# EAGLE schematic Hephaestus v1_5 (EAGLE 6.5.0)
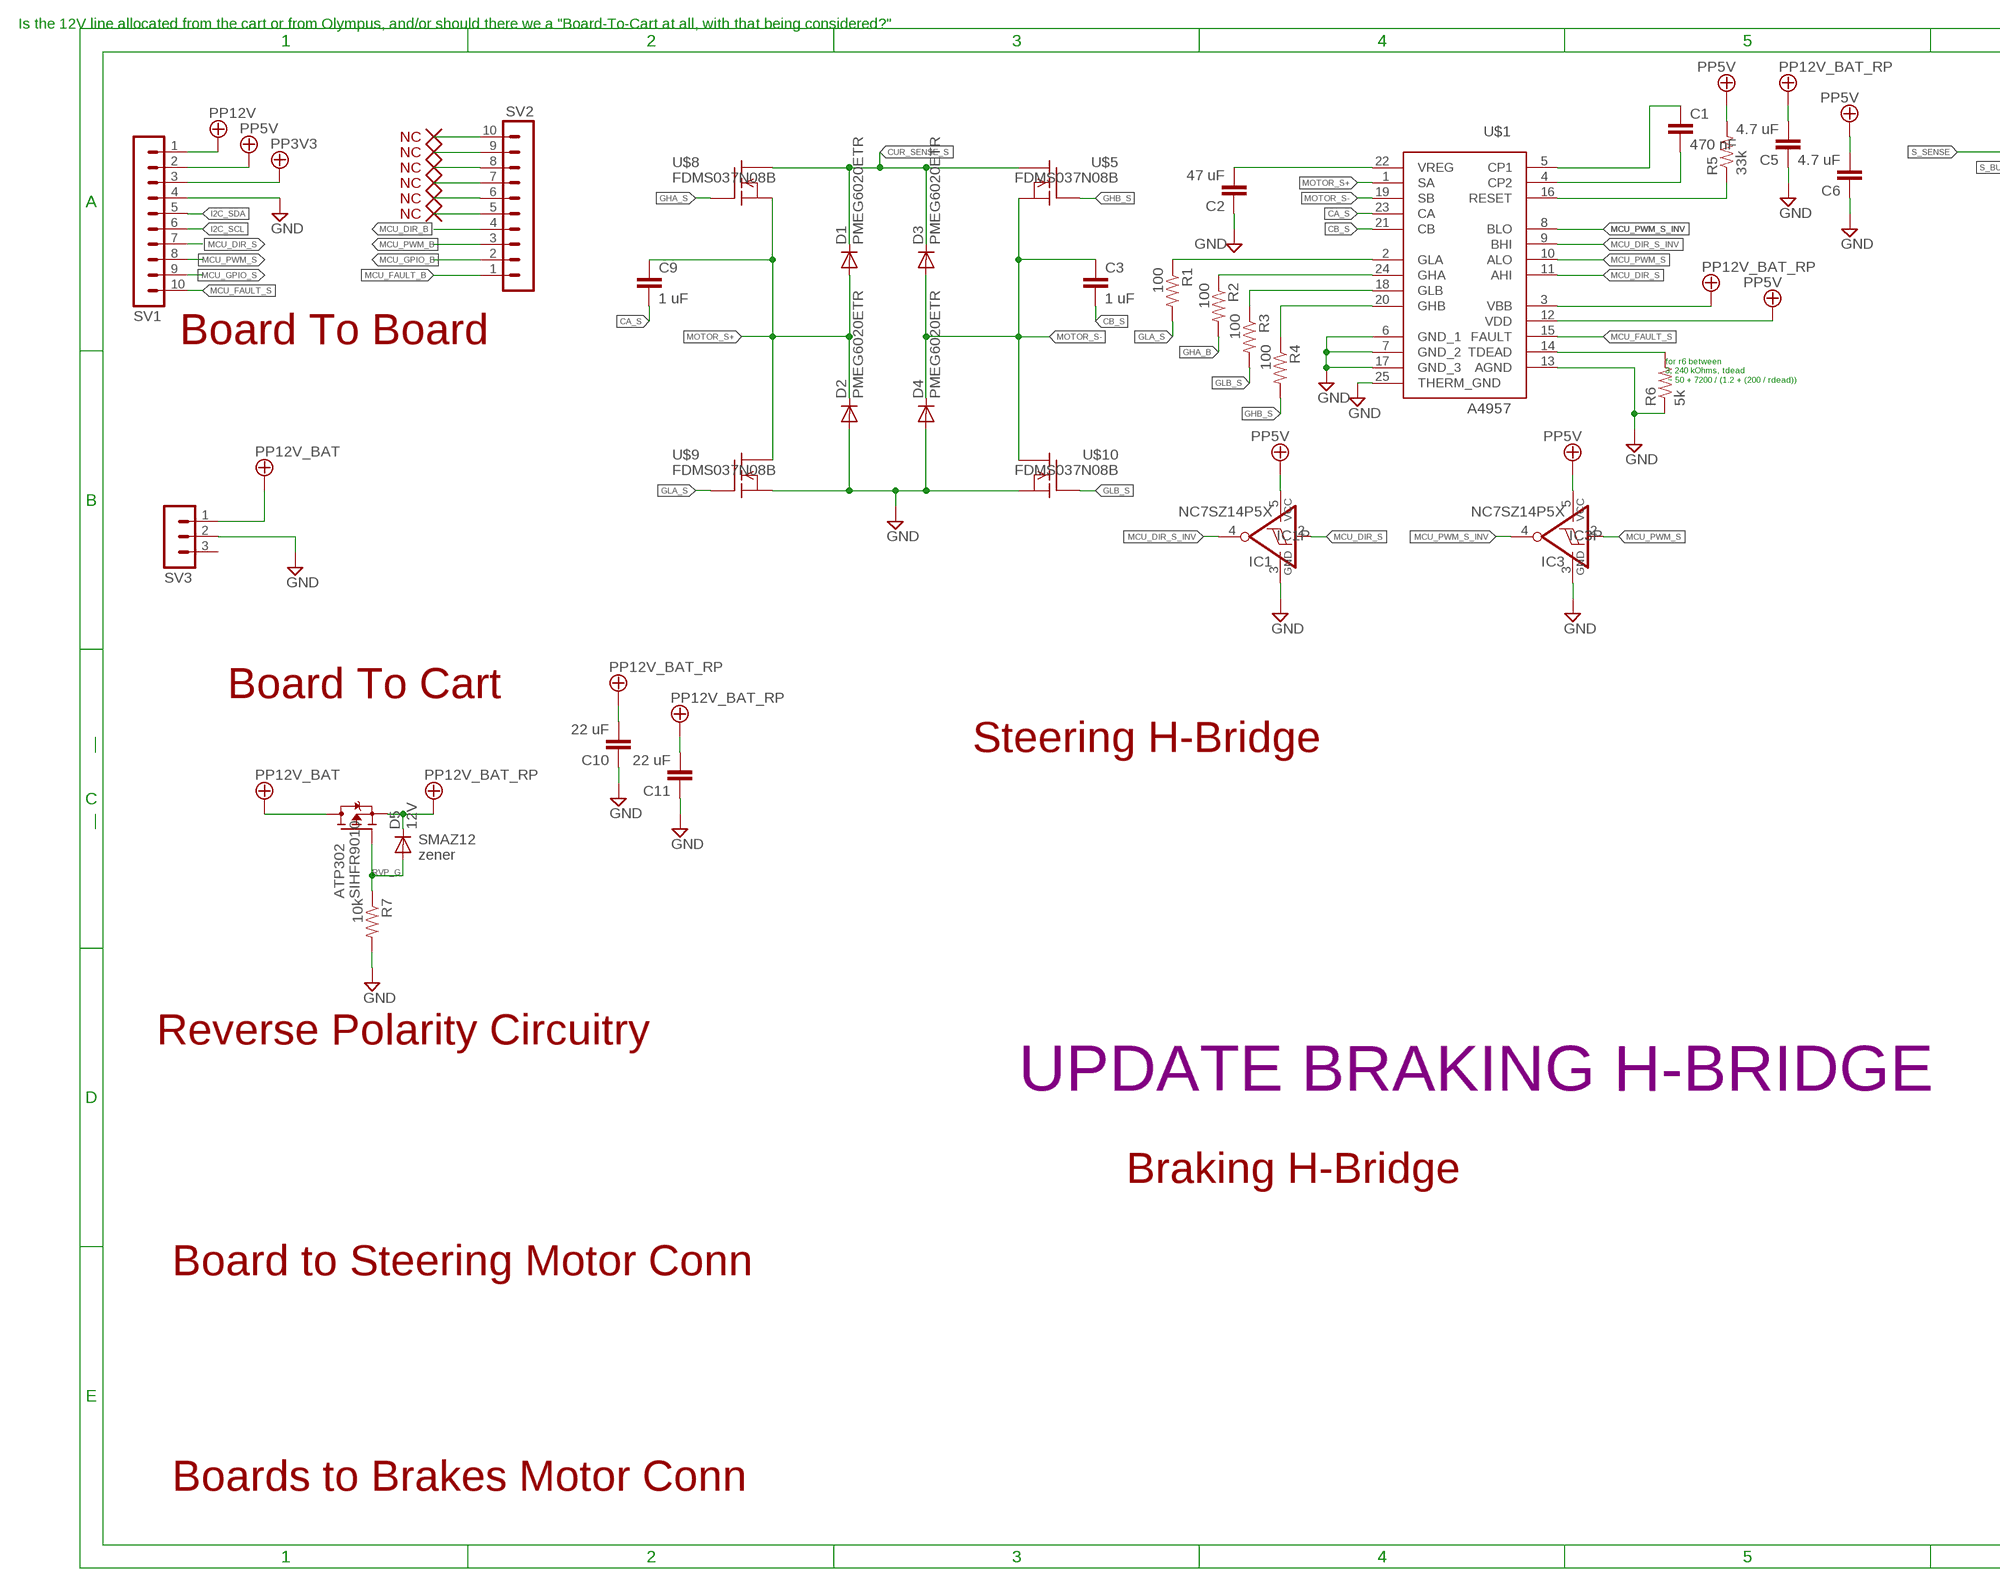
[diagram p0: schematic, sheet 1, part 1 of 2]
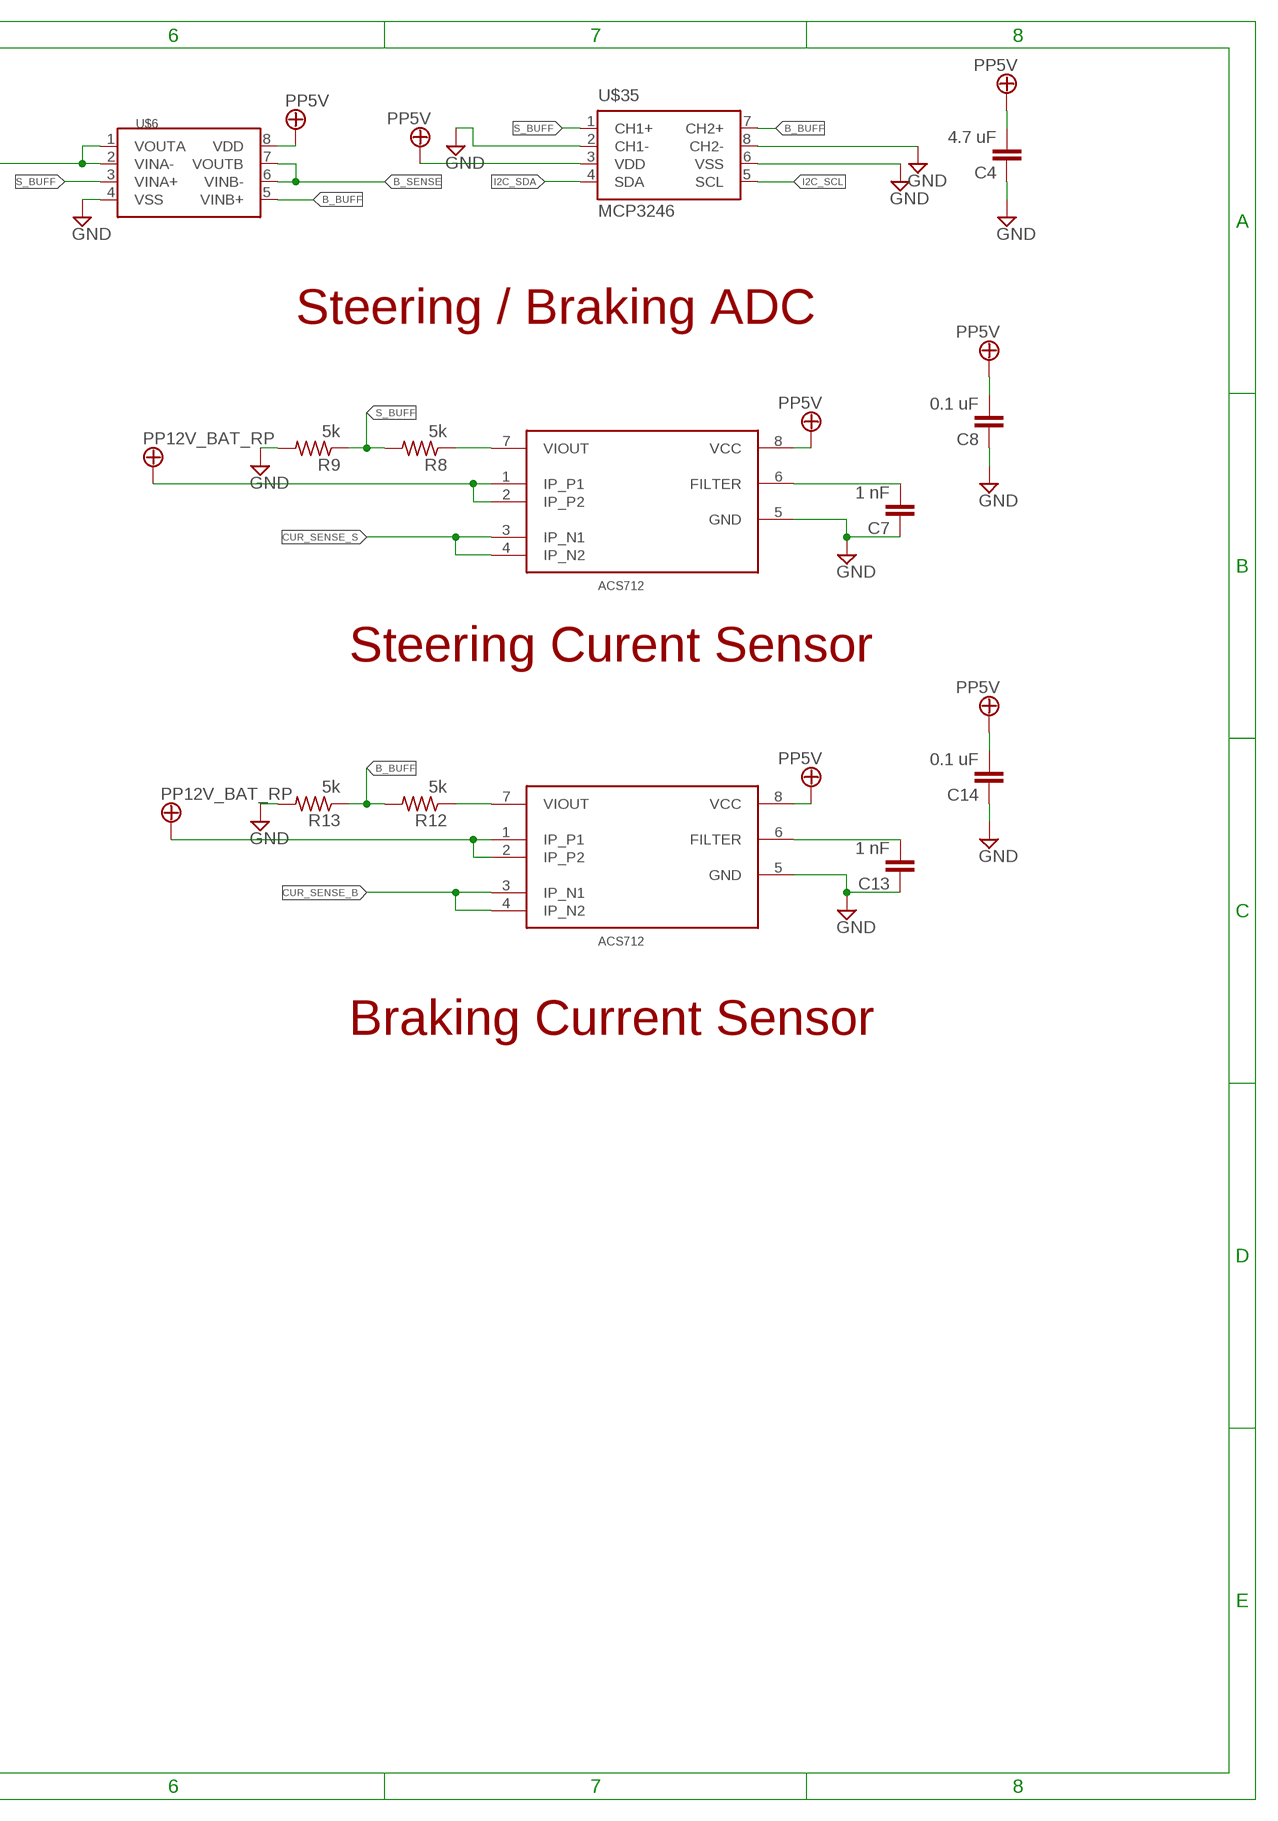
[diagram p1: schematic, sheet 1, part 2 of 2]

## Parts
ACS1  ACS712  [SOIC-08]
ACS712  ACS712  [SOIC-08]
C1  470 nF  CC0603  [C0603]
C2  47 uF  CC0603  [C0603]
C3  1 uF  CC0603  [C0603]
C4  4.7 uF  CC0603  [C0603]
C5  4.7 uF  CC0603  [C0603]
C6  4.7 uF  CC0603  [C0603]
C7  1 nF  CC0603  [C0603]
C8  0.1 uF  CC0603  [C0603]
C9  1 uF  CC0603  [C0603]
C10  22 uF  CC0603  [C0603]
C11  22 uF  CC0603  [C0603]
C13  1 nF  CC0603  [C0603]
C14  0.1 uF  CC0603  [C0603]
D1  PMEG6020ETR  [SOD123FL]
D2  PMEG6020ETR  [SOD123FL]
D3  PMEG6020ETR  [SOD123FL]
D4  PMEG6020ETR  [SOD123FL]
D5  12V  DIODE-DO214AC  [DO214AC]
IC1  NC7SZ14P5X  [SC70-5]
IC3  NC7SZ14P5X  [SC70-5]
R1  100  R-US_R0603  [R0603]
R2  100  R-US_R0603  [R0603]
R3  100  R-US_R0603  [R0603]
R4  100  R-US_R0603  [R0603]
R5  33k  R-US_R0603  [R0603]
R6  5k  R-US_R0603  [R0603]
R7  10k  R-US_R0603  [R0603]
R8  5k  R-US_R0603  [R0603]
R9  5k  R-US_R0603  [R0603]
R12  5k  R-US_R0603  [R0603]
R13  5k  R-US_R0603  [R0603]
SIHFR9010  ATP302  [TO252]
SV1  MA10-1  [MA10-1]
SV2  MA10-1  [MA10-1]
SV3  MA03-1  [MA03-1]
U$1  A4957  [24-WFQFN]
U$5  FDMS037N08B  [TO252]
U$6  MCP6L02  [SOIC-08]
U$8  FDMS037N08B  [TO252]
U$9  FDMS037N08B  [TO252]
U$10  FDMS037N08B  [TO252]
U$35  MCP3246  [MSOP8]

## Nets
B_BUFF: R12.2 R13.1 U$6.5(VINB+) U$35.7(CH2+)
B_SENSE: U$6.6(VINB-) U$6.7(VOUTB)
CA_S: C9.2 U$1.23(CA)
CB_S: C3.2 U$1.21(CB)
CS_1: ACS712.7(VIOUT) R8.1
CS_2: ACS1.7(VIOUT) R12.1
CUR_SENSE_B: ACS1.3(IP_N1) ACS1.4(IP_N2)
CUR_SENSE_S: ACS712.3(IP_N1) ACS712.4(IP_N2) D1.C D3.C U$5.1(D) U$8.1(D)
GHA_B: R2.2
GHA_S: U$8.2(G)
GHB_S: R4.2 U$5.2(G)
GLA_S: R1.2 U$9.2(G)
GLB_S: R3.2 U$10.2(G)
GND: ACS1.5(GND) ACS712.5(GND) C2.1 C4.1 C5.1 C6.1 C7.1 C8.1 C10.1 C11.1 C13.1 C14.1 D2.A D4.A IC1.3(GND) IC3.3(GND) R6.1 R7.2 R9.2 R13.2 SV1.4 SV3.2 U$1.6(GND_1) U$1.7(GND_2) U$1.13(AGND) U$1.17(GND_3) U$1.25(THERM_GND) U$6.4(VSS) U$9.3(S) U$10.3(S) U$35.2(CH1-) U$35.6(VSS) U$35.8(CH2-)
I2C_SCL: SV1.6 U$35.5(SCL)
I2C_SDA: SV1.5 U$35.4(SDA)
MCU_DIR_B: SV2.4
MCU_DIR_S: IC1.2(I) SV1.7 U$1.11(AHI)
MCU_DIR_S_INV: IC1.4(O) U$1.9(BHI)
MCU_FAULT_B: SV2.1
MCU_FAULT_S: SV1.10 U$1.15(FAULT)
MCU_GPIO_B: SV2.2
MCU_GPIO_S: SV1.9
MCU_PWM_B: SV2.3
MCU_PWM_S: IC3.2(I) SV1.8 U$1.10(ALO)
MCU_PWM_S_INV: IC3.4(O) U$1.8(BLO)
MOTOR_S+: C9.1 D1.A D2.C U$1.1(SA) U$8.3(S) U$9.1(D)
MOTOR_S-: C3.1 D3.A D4.C U$1.19(SB) U$5.3(S) U$10.1(D)
N$2: SV2.5
N$3: SV2.6
N$4: C1.1 U$1.5(CP1)
N$5: R3.1 U$1.18(GLB)
N$6: R4.1 U$1.20(GHB)
N$7: C1.2 U$1.4(CP2)
N$8: R6.2 U$1.14(TDEAD)
N$10: SV2.7
N$11: C2.2 U$1.22(VREG)
N$13: SV2.8
N$15: R1.1 U$1.2(GLA)
N$16: R2.1 U$1.24(GHA)
N$19: SV2.9
N$20: SV2.10
N$22: ACS712.6(FILTER) C7.2
N$24: ACS1.6(FILTER) C13.2
N$32: R5.1 U$1.16(RESET)
PP3V3: SV1.3
PP5V: ACS1.8(VCC) ACS712.8(VCC) C4.2 C6.2 C8.2 C14.2 IC1.5(VCC) IC3.5(VCC) R5.2 SV1.1 SV1.2 U$1.12(VDD) U$6.8(VDD) U$35.3(VDD) ; supply symbol labelled PP12V
PP12V_2: ACS1.1(IP_P1) ACS1.2(IP_P2) ACS712.1(IP_P1) ACS712.2(IP_P2) C5.2 C10.2 C11.2 D5.C SIHFR9010.1(D) SIHFR9010.3(S) SV3.1 U$1.3(VBB) ; supply symbol labelled PP12V_BAT_RP, PP12V_BAT
RVP_G: D5.A R7.1 SIHFR9010.2(G)
S_BUFF: R8.2 R9.1 U$6.3(VINA+) U$35.1(CH1+)
S_SENSE: U$6.1(VOUTA) U$6.2(VINA-)
Unconnected: SV3.3

## Notes on the sheet
- Is the 12V line allocated from the cart or from Olympus, and/or should there we a "Board-To-Cart at all, with that being considered?"
- Steering / Braking ADC
- Board To Board
- for r6 between 
  3, 240 kOhms, tdead
   ~ 50 + 7200 / (1.2 + (200 / rdead))
- Steering Curent Sensor
- Board To Cart
- Steering H-Bridge
- SMAZ12
- zener
- Braking Current Sensor
- Reverse Polarity Circuitry
- UPDATE BRAKING H-BRIDGE
- Braking H-Bridge
- Board to Steering Motor Conn
- Boards to Brakes Motor Conn

## Library data of the parts
ACS1 ACS712 = heph_custom_comp:ACS712
C1-C11 C13 C14 = eagle-ltspice:C: CAPACITOR, European symbol; SPICEMODEL: NONE; SPICEPREFIX: C
D1-D4 = heph_custom_comp:PMEG6020ETR
D5 = diode:DIODE-: DIODE
IC1 IC3 = 74xx-little-de:NC7SZ14: TinyLogic(R) UHS Inverter with Schmitt Trigger Input Source: http://www.fairchildsemi.com/ds/NC/NC7SZ14.pdf
R1-R9 R12 R13 = rcl:R-US_: RESISTOR, American symbol
SIHFR9010 = heph_custom_comp:ATP302
SV1 SV2 = con-lstb:MA10-1: PIN HEADER; OC_FARNELL: unknown; OC_NEWARK: unknown
SV3 = con-lstb:MA03-1: PIN HEADER; OC_FARNELL: unknown; OC_NEWARK: unknown
U$1 = heph_custom_comp:A4957; DIGI: 620-1491-1-ND
U$5 U$8-U$10 = heph_custom_comp:FDMS037N08B
U$6 = heph_custom_comp:MCP6L02
U$35 = heph_custom_comp:MCP3246; DIG: MCP3426A0-E/SN-ND